# Altium schematic sheet NiHAAx1to6.SchDoc
size A4
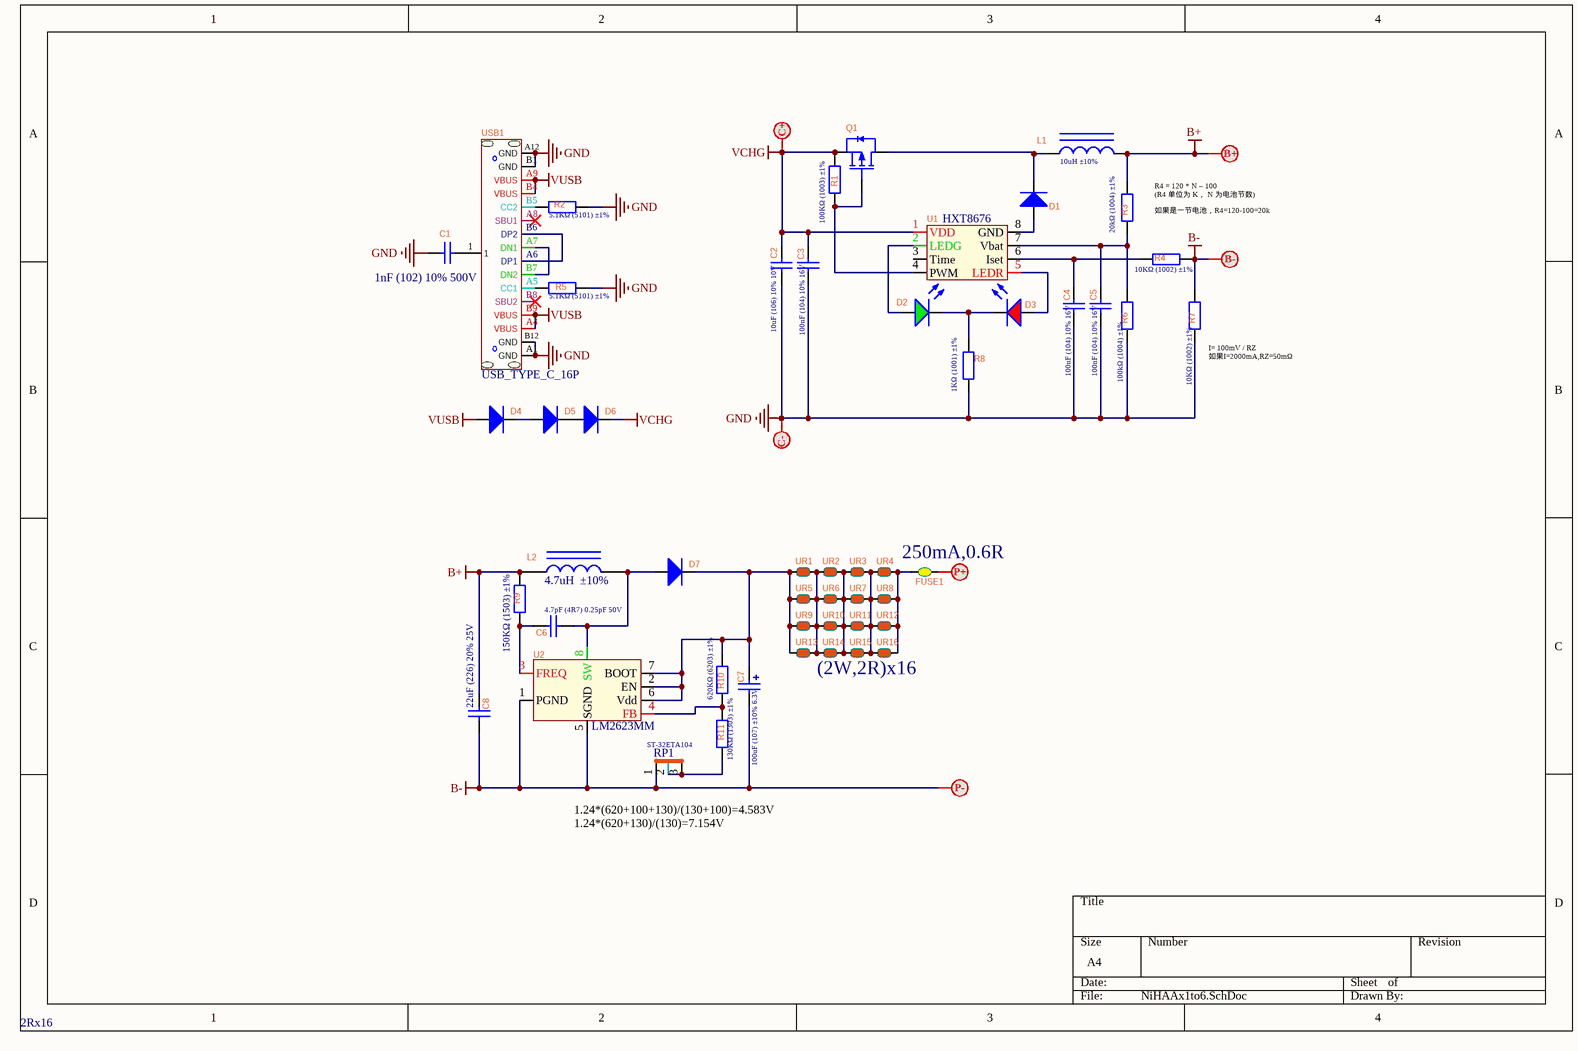
[diagram p0: NiHAAx1to6.SchDoc]

## Parts
B+1  B+  [TAP]  (value not drawn)
B-1  B-  [TAP]  (value not drawn)
C1  1nF (102) 10% 500V  [1206_C]
C2  10uF (106) 10% 10V  [0603_C]
C3  100nF (104) 10% 16V  [0402_C]
C4  100nF (104) 10% 16V  [0402_C]
C5  100nF (104) 10% 16V  [0402_C]
C6  4.7pF (4R7) 0.25pF 50V  [0402_C]
C7  100uF (107) ±10% 6.3V  [CASE-B_3528]
C8  22uF (226) 20% 25V  [0805_C]
C+1  C+  [TAP]  (value not drawn)
C-1  C-  [TAP]  (value not drawn)
D1  M7  [CMS01]  (value not drawn)
D2  绿灯 0603  [0603_LED_S1]  (value not drawn)
D3  红灯 0603  [0603_LED_S1]  (value not drawn)
D4  M7  [CMS01]  (value not drawn)
D5  M7  [CMS01]  (value not drawn)
D6  M7  [CMS01]  (value not drawn)
D7  M7  [CMS01]  (value not drawn)
FUSE1  OMF125  [2512]  (value not drawn)
L1  10uH ±10%  [1206_L]
L2  4.7uH  ±10%  [1206_L]
P+1  P+  [TAP]  (value not drawn)
P-1  P-  [TAP]  (value not drawn)
Q1  AO3401A P道沟 X13A15 SOT-23  [SOT-23-3L]  (value not drawn)
R1  100KΩ (1003) ±1%  [0402_R]
R2  5.1KΩ (5101) ±1%  [0402_R]
R3  20kΩ (1004) ±1%  [0402_R]
R4  10KΩ (1002) ±1%  [0402_R]
R5  5.1KΩ (5101) ±1%  [0402_R]
R6  100kΩ (1004) ±1%  [0402_R]
R7  10KΩ (1002) ±1%  [0805_R]
R8  1KΩ (1001) ±1%  [0402_R]
R9  150KΩ (1503) ±1%  [0402_R]
R10  620KΩ (6203) ±1%  [0603_R]
R11  130KΩ (1303) ±1%  [0603_R]
RP1  ST-32ETA104  [ST-32ETA104]
U1  HXT8676  [SOP-8_150mil]
U2  LM2623MM  [VSSOP8_3×3mm]
UR1  R  [2512]  (value not drawn)
UR2  R  [2512]  (value not drawn)
UR3  R  [2512]  (value not drawn)
UR4  R  [2512]  (value not drawn)
UR5  R  [2512]  (value not drawn)
UR6  R  [2512]  (value not drawn)
UR7  R  [2512]  (value not drawn)
UR8  R  [2512]  (value not drawn)
UR9  R  [2512]  (value not drawn)
UR10  R  [2512]  (value not drawn)
UR11  R  [2512]  (value not drawn)
UR12  R  [2512]  (value not drawn)
UR13  R  [2512]  (value not drawn)
UR14  R  [2512]  (value not drawn)
UR15  R  [2512]  (value not drawn)
UR16  R  [2512]  (value not drawn)
USB1  USB_TYPE_C_16P  [USB Type-C-16Pin_A]

## Nets
B+: B+1.1(B+) C8.2 L1.2 L2.1 R3.2 R9.2
B-: B-1.1(B-) C7.2 C8.1 P-1.1(P-) R4.2 R7.2 RP1.1 U2.1(PGND) U2.5(SGND)
GND: C1.2 C2.1 C3.1 C4.1 C5.1 C-1.1(C-) R2.1 R5.1 R6.2 R7.1 R8.1 USB1.A1(GND) USB1.A12(GND) USB1.B1(GND) USB1.B12(GND)
VCHG: C2.2 C3.2 C+1.1(C+) D6.2(K) Q1.2(S) R1.2 U1.1(VDD)
VUSB: D4.1(A) USB1.A4(VBUS) USB1.A9(VBUS) USB1.B4(VBUS) USB1.B9(VBUS)
NetC1_1: C1.1 USB1.1
NetC4_2: C4.2 R4.1 U1.6(Iset)
NetC5_2: C5.2 R3.1 R6.1 U1.7(Vbat)
NetC6_1: C6.1 R9.1 U2.3(FREQ)
NetC6_2: C6.2 D7.1(A) L2.2 U2.8(SW)
NetC7_1: C7.1 D7.2(K) R10.2 U2.2(EN) U2.6(Vdd) U2.7(BOOT) UR1.1 UR5.1 UR9.1 UR13.1
NetD1_1: D1.1(A) U1.8(GND)
NetD1_2: D1.2(K) L1.1 Q1.3(D)
NetD2_A: D2.A U1.2(LEDG)
NetD2_K: D2.K D3.K R8.2
NetD3_A: D3.A U1.5(LEDR)
NetD4_2: D4.2(K) D5.1(A)
NetD5_2: D5.2(K) D6.1(A)
NetFUSE1_1: FUSE1.1 P+1.1(P+)
NetFUSE1_2: FUSE1.2 UR4.2 UR8.2 UR12.2 UR16.2
NetQ1_1: Q1.1(G) R1.1 U1.4(PWM)
NetR2_2: R2.2 USB1.B5(CC2)
NetR5_2: R5.2 USB1.A5(CC1)
NetR10_1: R10.1 R11.2 U2.4(FB)
NetR11_1: R11.1 RP1.2 RP1.3
NetUR1_2: UR1.2 UR2.1 UR5.2 UR6.1 UR9.2 UR10.1 UR13.2 UR14.1
NetUR2_2: UR2.2 UR3.1 UR6.2 UR7.1 UR10.2 UR11.1 UR14.2 UR15.1
NetUR3_2: UR3.2 UR4.1 UR7.2 UR8.1 UR11.2 UR12.1 UR15.2 UR16.1
NetUSB1_A6: USB1.A6(DP1) USB1.B6(DP2)
NetUSB1_A7: USB1.A7(DN1) USB1.B7(DN2)

Not connected (* = marked no-connect by the designer): U1 3(Time); USB1 A8(SBU1)* B8(SBU2)*

## Notes on the sheet
- R4 = 120 * N – 100
  (R4 单位为 K， N 为电池节数)
  如果是一节电池，R4=120-100=20k
- (near R7) I= 100mV / RZ
  如果I=2000mA,RZ=50mΩ
- 250mA,0.6R
- (2W,2R)x16
- 1.24*(620+100+130)/(130+100)=4.583V
  1.24*(620+130)/(130)=7.154V
- 2Rx16

## Library data of the parts
C1 = 1206 1nF (102) 10% 500V: 贴片电容; ComponentLink1Description: 供应商链接; ComponentLink1URL: http://www.szlcsc.com/product/details_36187.html; Package: 1206; Supplier: LC; SuppliersPartNumber: C35216
C2 = 0603 10uF (106) 10% 10V: 贴片电容; ComponentLink1Description: 供应商链接; ComponentLink1URL: http://www.szlcsc.com/product/details_20411.html; Package: 0603; Supplier: LC; SuppliersPartNumber: C19702
C3-C5 = 0402 100nF (104) 10% 16V: 贴片电容; ComponentLink1Description: 供应商链接; ComponentLink1URL: http://www.szlcsc.com/product/details_1877.html; Package: 0402; Supplier: LC; SuppliersPartNumber: C1525
C6 = 0402 4.7pF (4R7) 0.25pF 50V: 贴片电容; ComponentLink1Description: 供应商链接; ComponentLink1URL: http://www.szlcsc.com/product/details_1921.html; Package: 0402; Supplier: LC; SuppliersPartNumber: C1569
C7 = 3528 100uF (107) 10% 6.3V: 钽电容; ComponentLink1Description: 供应商链接; ComponentLink1URL: http://www.szlcsc.com/product/details_16815.html; Package: 3528; Supplier: LC; SuppliersPartNumber: C16133
C8 = 0805 22uF (226) 20% 25V: 贴片电容; ComponentLink1Description: 供应商链接; ComponentLink1URL: http://www.szlcsc.com/product/details_46786.html; Package: 0805; Supplier: LC; SuppliersPartNumber: C45783
D1 D4-D7 = SMA(DO-214AC) M7: 二极管; 备注: 1N4007 4007 编号C2464 已经停售, 使用新物料编号C95872; ComponentLink1Description: 供应商链接; ComponentLink1URL: http://www.szlcsc.com/product/details_2841.html; Package: SMA(DO-214AC); Supplier: LC; SuppliersPartNumber: C95872
D2 = 0603 绿灯: 发光二极管; ComponentLink1Description: 供应商链接; ComponentLink1URL: http://www.szlcsc.com/product/details_73152.html; Package: 0603; Supplier: LC; SuppliersPartNumber: C72043
D3 = 0603 红灯: 发光二极管; ComponentLink1Description: 供应商链接; ComponentLink1URL: http://www.szlcsc.com/product/details_2659.html; Package: 0603; Supplier: LC; SuppliersPartNumber: C2286
FUSE1 = FUSE: 3404.0006.22 OMF125 250mA OMF125 SCHURTER 贴装快速熔断保险丝
L1 = 1206 10uH 10%: 贴片电感; ComponentLink1Description: 供应商链接; ComponentLink1URL: http://www.szlcsc.com/product/details_1403.html; Package: 1206; Supplier: LC; SuppliersPartNumber: C1051
L2 = 1206 4.7uH  10%: 贴片电感; ComponentLink1Description: 供应商链接; ComponentLink1URL: http://www.szlcsc.com/product/details_1401.html; Package: 1206; Supplier: LC; SuppliersPartNumber: C1049
Q1 = AO3401A P道沟 X13A15 SOT-23: MOS(场效应管); ComponentLink1Description: 供应商链接; ComponentLink1URL: http://www.szlcsc.com/product/details_15801.html; Package: SOT-23; Supplier: LC; SuppliersPartNumber: C15127
R1 = 0402 100KΩ (1003) 1%: 贴片电阻; ComponentLink1Description: 供应商链接; ComponentLink1URL: http://www.szlcsc.com/product/details_26484.html; Package: 0402; Supplier: LC; SuppliersPartNumber: C25741
R2 R5 = 0402 5.1KΩ (5101) 1%: 贴片电阻; ComponentLink1Description: 供应商链接; ComponentLink1URL: http://www.szlcsc.com/product/details_26648.html; Package: 0402; Supplier: LC; SuppliersPartNumber: C25905
R3 R6 = 0402 1MΩ (1004) 1%: 贴片电阻; ComponentLink1Description: 供应商链接; ComponentLink1URL: http://www.szlcsc.com/product/details_26826.html; Package: 0402; Supplier: LC; SuppliersPartNumber: C26083
R4 R7 = 0402 10KΩ (1002) 1%: 贴片电阻; ComponentLink1Description: 供应商链接; ComponentLink1URL: http://www.szlcsc.com/product/details_26487.html; Package: 0402; Supplier: LC; SuppliersPartNumber: C25744
R8 = 0402 1KΩ (1001) 1%: 贴片电阻; ComponentLink1Description: 供应商链接; ComponentLink1URL: http://www.szlcsc.com/product/details_12256.html; Package: 0402; Supplier: LC; SuppliersPartNumber: C11702
R9 = 0402 150KΩ (1503) 1%: 贴片电阻; ComponentLink1Description: 供应商链接; ComponentLink1URL: http://www.szlcsc.com/product/details_26498.html; Package: 0402; Supplier: LC; SuppliersPartNumber: C25755
R10 = 0603 620KΩ (6203) 1%: 贴片电阻; ComponentLink1Description: 供应商链接; ComponentLink1URL: http://www.szlcsc.com/product/details_23946.html; Package: 0603; Supplier: LC; SuppliersPartNumber: C23219
R11 = 0603 130KΩ (1303) 1%: 贴片电阻; ComponentLink1Description: 供应商链接; ComponentLink1URL: http://www.szlcsc.com/product/details_23522.html; Package: 0603; Supplier: LC; SuppliersPartNumber: C22795
RP1 = RP: 3X3 SMD可调电阻 贴片电位器
U1 = HXT8676: 镍氢电池充电 IC
U2 = LM2623: 3 General-Purpose, Gated-Oscillator-Based DC-DC Boost Converter
USB1 = USB_TYPE_C_16P: ComponentLink1Description: 供应商链接